# Altium schematic sheet BMS_Gauges_and_measure.SchDoc
size A4
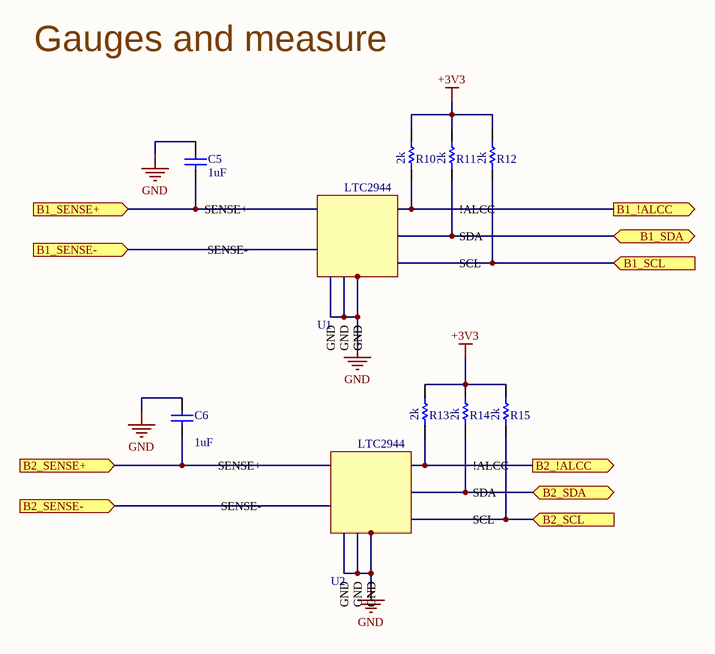
[diagram p0: BMS_Gauges_and_measure.SchDoc]

## Parts
C5  value 1uF  [C0805]  (hidden comment: Cap_1)
C6  value 1uF  [C0805]  (hidden comment: Cap_1)
R10  Res_2k  [C0805]  (value not drawn)
R11  Res_2k  [C0805]  (value not drawn)
R12  Res_2k  [C0805]  (value not drawn)
R13  Res_2k  [C0805]  (value not drawn)
R14  Res_2k  [C0805]  (value not drawn)
R15  Res_2k  [C0805]  (value not drawn)
U1  LTC2944  [DFN-8_DD_Gauges]  (value not drawn)
U2  LTC2944  [DFN-8_DD_Gauges]  (value not drawn)

## Ports
B1_!ALCC (out), B1_SCL (in), B1_SDA (bidir), B1_SENSE+ (in), B1_SENSE- (in), B2_!ALCC (out), B2_SCL (in), B2_SDA (bidir), B2_SENSE+ (in), B2_SENSE- (in)

## Nets
+3V3: R10.2 R11.2 R12.2 R13.2 R14.2 R15.2
GND: C5.2 C6.2 U1.2(GND) U1.3(GND) U1.7(GND) U1.9(GND) U2.2(GND) U2.3(GND) U2.7(GND) U2.9(GND)
B1_!ALCC: R10.1 U1.6(!ALCC) ; port B1_!ALCC
B1_SCL: R12.1 U1.4(SCL) ; port B1_SCL
B1_SDA: R11.1 U1.5(SDA) ; port B1_SDA
B1_SENSE+: C5.1 U1.1(SENSE+) ; port B1_SENSE+
B1_SENSE-: U1.8(SENSE-) ; port B1_SENSE-
B2_!ALCC: R13.1 U2.6(!ALCC) ; port B2_!ALCC
B2_SCL: R15.1 U2.4(SCL) ; port B2_SCL
B2_SDA: R14.1 U2.5(SDA) ; port B2_SDA
B2_SENSE+: C6.1 U2.1(SENSE+) ; port B2_SENSE+
B2_SENSE-: U2.8(SENSE-) ; port B2_SENSE-

## Notes on the sheet
- Gauges and measure
- Title
- Size:
- Date:
- Battery Management System
- A4
- Number:
- Time:
- 1
- Revision:
- Author: GEI Corp
- V1.0
- GEI Corp
- 135 avenue de Rangueil
- INSA Toulouse
- 31400 Toulouse
- FRANCE
- File:
- Projet_Inter_1\BMS_GEI_CORP
- (in symbol Res_2k) 2k

## Library data of the parts
C5 C6 = Cap_1: Capacitor; Published: 8-Jun-2000; LatestRevisionDate: 17-Jul-2002; LatestRevisionNote: Re-released for DXP Platform.; PackageReference: RAD-0.3; Publisher: Altium Limited; PackageDescription: Radial Cap, Thru-Hole; 2 Leads; 0.3 in Pin Spacing
R10-R15 = Res_2k: Resistor
U1 U2 = LTC2944: Gas gauge